# EAGLE design BPU_display (EAGLE 9.1.3)
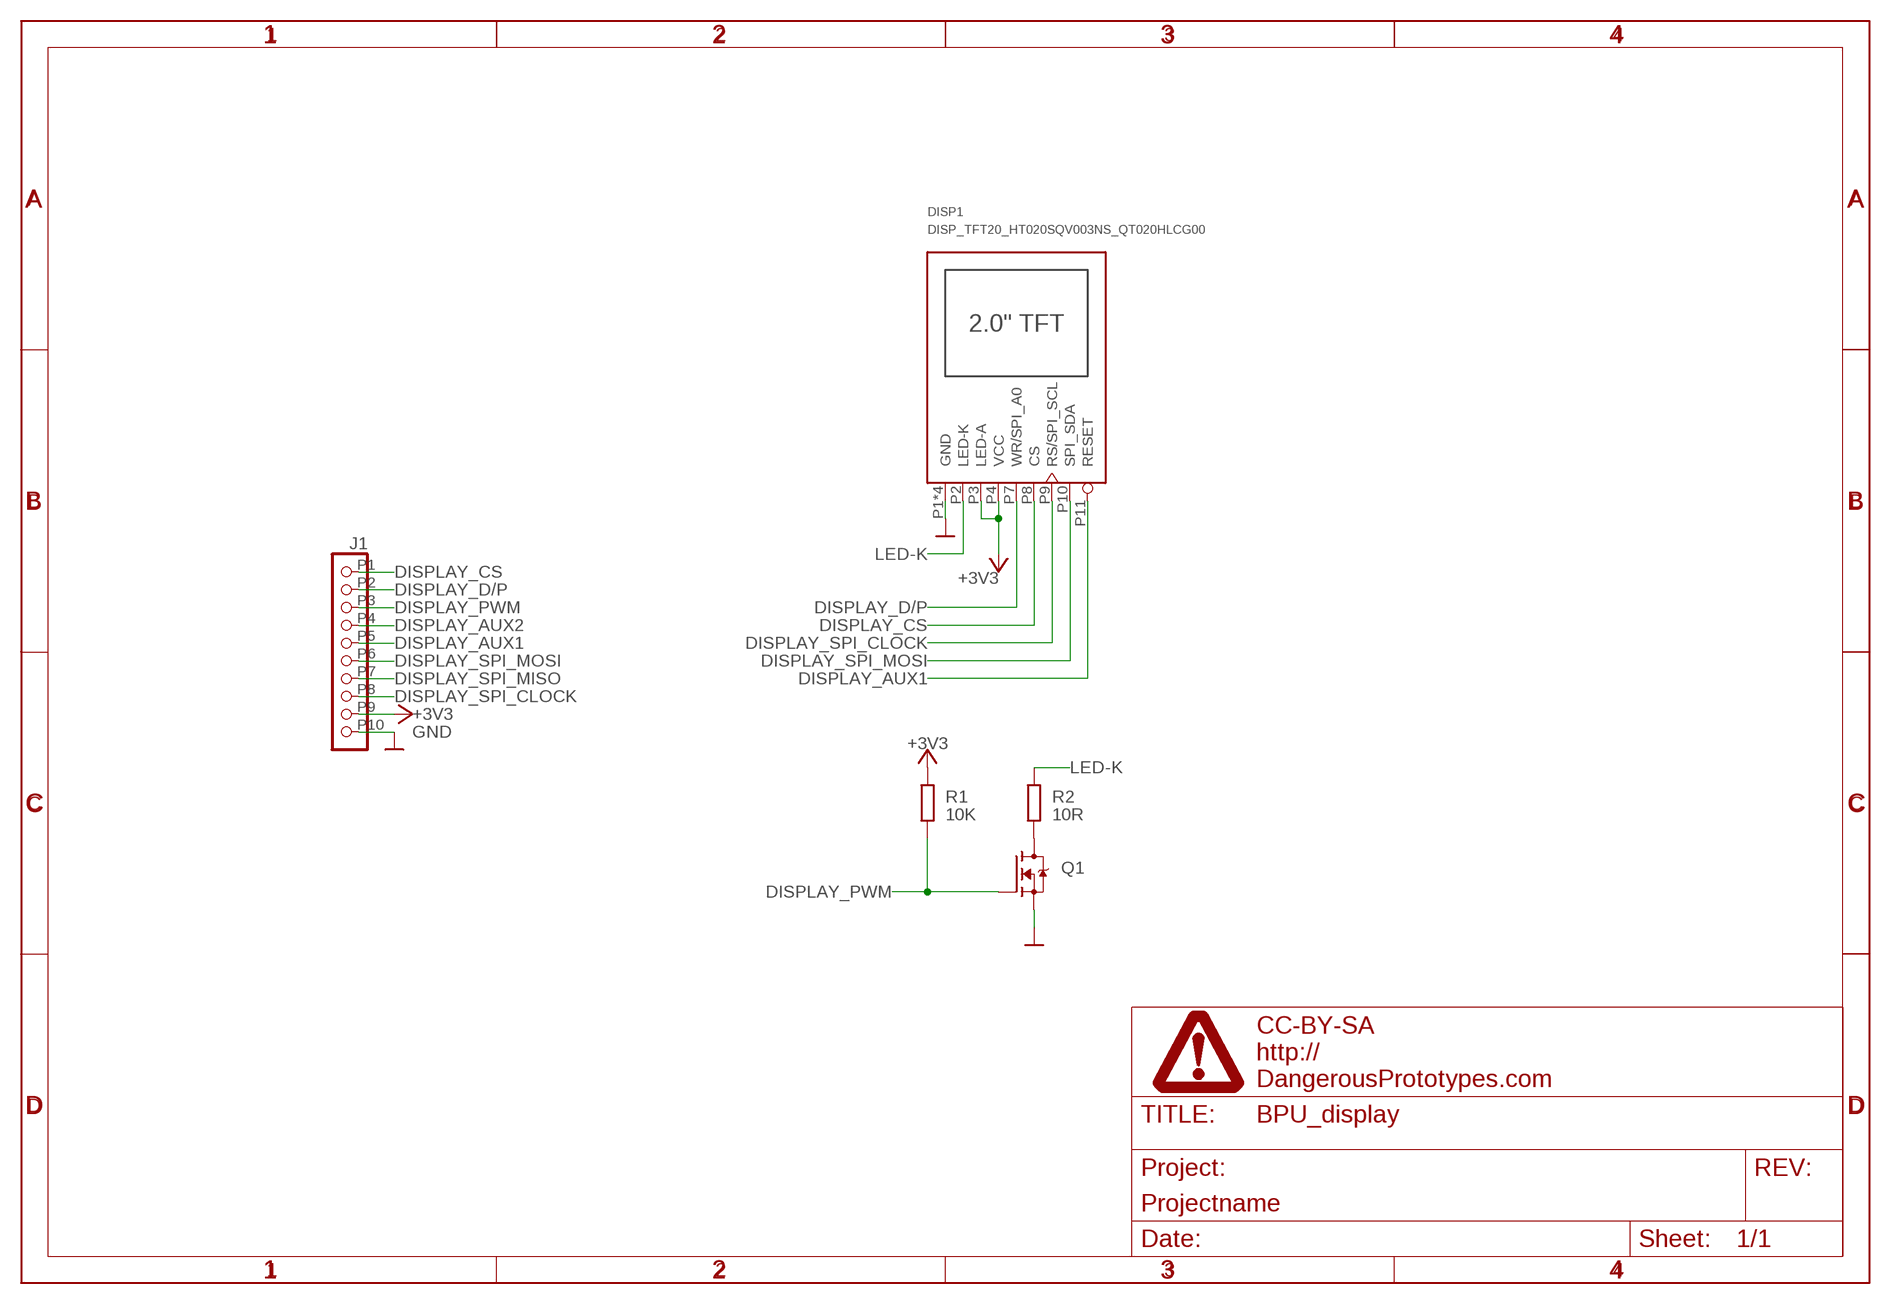
[diagram p0: schematic, sheet 1]

## Parts
DISP1  DISP_TFT20_HT020SQV003NS_QT020HLCG00  [HT020SQV003NS_QT020HLCG00]
J1  CON_MOLEX_MALE_SMT_RIGHT_ANGLE_1.25  [MOLEX_532611071]
PAGE1  FRAME_DINA4_L  [DP_LOGO]
Q1  TRANSISTOR_FET_BS170-SOT-23  [SOT-23]
R1  10K  R-EU_R0603  [R0603]
R2  10R  R-EU_R0603  [R0603]

## Nets
+3V3: DISP1.P3(LED-A) DISP1.P4(VCC) J1.P9 R1.2 ; supply symbol labelled SUPPLY_+3V3
DISPLAY_AUX1: DISP1.P11(RESET) J1.P5
DISPLAY_AUX2: J1.P4
DISPLAY_CS: DISP1.P8(CS) J1.P1
DISPLAY_D/P: DISP1.P7(WR/SPI_A0) J1.P2
DISPLAY_PWM: J1.P3 Q1.1(G) R1.1
DISPLAY_SPI_CLOCK: DISP1.P9(RS/SPI_SCL) J1.P8
DISPLAY_SPI_MISO: J1.P7
DISPLAY_SPI_MOSI: DISP1.P10(SPI_SDA) J1.P6
GND: DISP1.P1(GND) DISP1.P5(GND) DISP1.P6(GND) DISP1.P12(GND) J1.P10 Q1.2(S) ; supply symbol labelled SUPPLY_GND
LED-K: DISP1.P2(LED-K) R2.2
N$2: Q1.3(D) R2.1

## Library data of the parts
DISP1 = dp_devices.v6:DISP_TFT20_HT020SQV003NS_QT020HLCG00: 2 in 1 2.0" TFT display, HT020SQV003NS and QT020HLCG00
J1 = dp_devices.v6:CON_MOLEX_MALE_SMT_RIGHT_ANGLE_1.25: Molex 1.25mm PicoBlade Header right angle SMT 10 circuits p/n: 532611071
PAGE1 = dp_devices.v6:FRAME_DINA4_L: A4 DP frame Standard Dangerous Prototypes schematic frame. Automagically adds the DP logo and standard texts to the PCB Use the atrribute in the schematic editor to change the fields.; FF1: fulfillment by; FF2: Seeed Studio; FF3: www.seeedstudio.com; LICENSE: CC-BY-SA; PROJECT: Projectname; URL1: http://; URL2: DangerousPrototypes.com
Q1 = dp_devices.v6:TRANSISTOR_FET_BS170: N-Channel Enhancement Mode Field Effect Transistor
R1 R2 = rcl:R-EU_: RESISTOR, European symbol; SPICEPREFIX: R

## Board
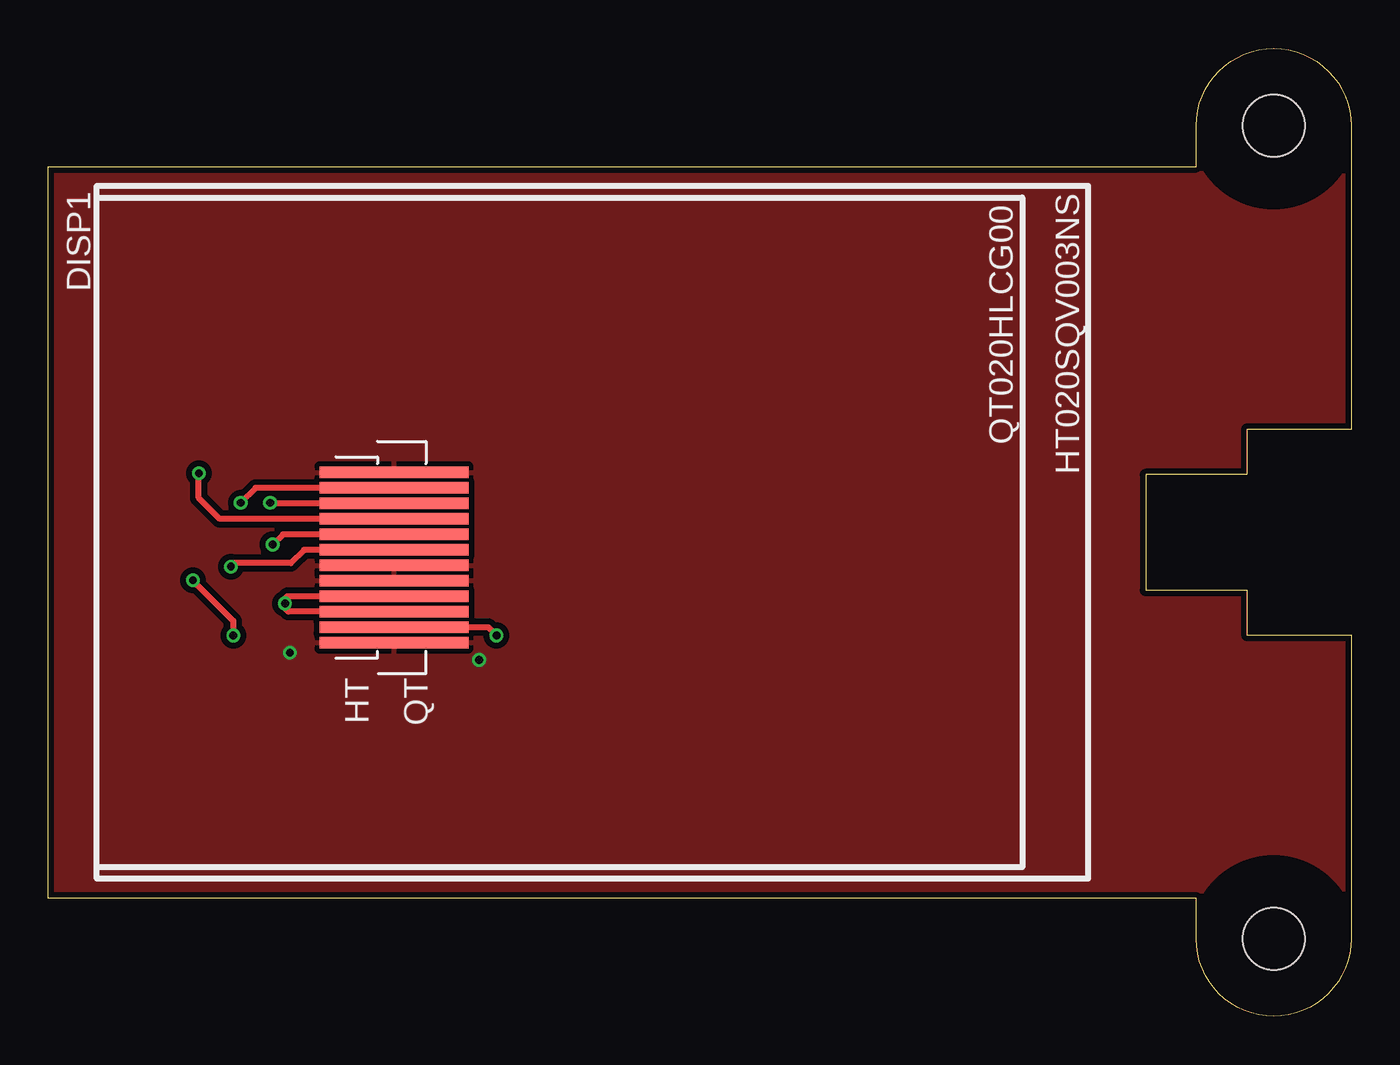
[diagram p1: board, top side]
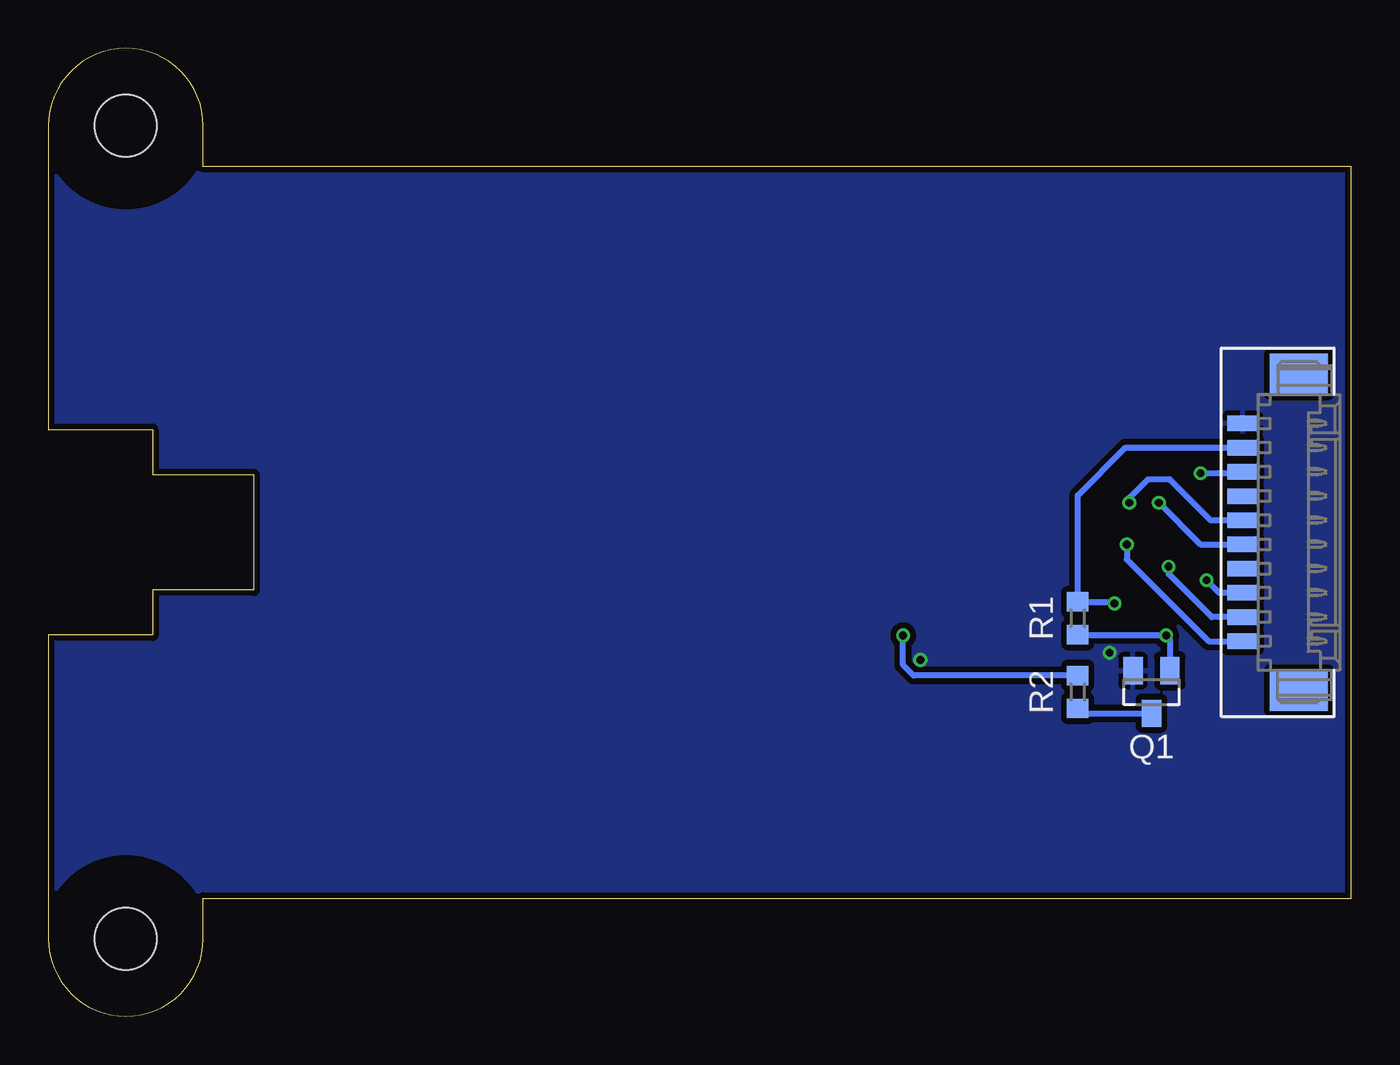
[diagram p2: board, bottom side, seen from below]

Size 67.29 x 50 mm. Coordinates in mm from the lower left corner, seen from the top.
Outline: 0,43.9 59.29,43.9 59.29,46 arc-180 67.29,46 67.29,30.31 61.91,30.31 61.91,27.98 56.68,27.98 56.68,22.02 61.91,22.02 61.91,19.69 67.29,19.69 67.29,4 arc-180 59.29,4 59.29,6.1 0,6.1 0,43.9
Copper layers (1*16): Top 0.035mm / dielectric 1.5mm / Bottom 0.035mm
Design rules "dirt_cheap_dirty_boards.v1.1": minimum track width 6mil, minimum drill 12mil, track to track 6mil, track to pad 6mil, pad to pad 6mil, via to via 6mil, smd to smd 0mil, copper to edge 10mil, drill to drill 10mil, minimum pad ring 10mil, minimum via ring 6mil, stop-mask expansion 2mil, vias tented up to drill 25mil, thermal gap 10mil
Holes 3.2 mm at 63.29,46 63.29,4
tRestrict: area 59.3,42 to 67.3,50; area 59.3,0 to 67.3,8
bRestrict: area 59.3,0 to 67.3,8; area 59.3,42 to 67.3,50

### Footprints (pad centres in the part's own frame; a part is rotated, then mirrored left to right if it is on the bottom)
HT020SQV003NS_QT020HLCG00 = smd 0.6 x 7.7: P1 5.7,-10.25; P2 4.9,-10.25; P3 4.1,-10.25; P4 3.3,-10.25; P5 2.5,-10.25; P6 1.7,-10.25; P7 0.9,-10.25; P8 0.1,-10.25; P9 -0.7,-10.25; P10 -1.5,-10.25; P11 -2.3,-10.25; P12 -3.1,-10.25
MOLEX_532611071 = smd 2.1 x 3: B1 -8.175,0; B2 8.175,0 | smd 0.8 x 1.6: P1 -5.625,2.9; P2 -4.375,2.9; P3 -3.125,2.9; P4 -1.875,2.9; P5 -0.625,2.9; P6 0.625,2.9; P7 1.875,2.9; P8 3.125,2.9; P9 4.375,2.9; P10 5.625,2.9
SOT-23 = smd 1 x 1.4: 1 -0.95,-1.1; 2 0.95,-1.1; 3 0,1.1
R0603 = smd 1 x 1.1: 1 -0.85,0; 2 0.85,0

### Placement (x,y rotation side)
DISP1  28.1,25 270 top
J1  2.7,25 90 bottom
PAGE1  3.96,0.24 0 top
Q1  10.32,16.75 180 bottom
R1  14.12,20.56 90 bottom
R2  14.12,16.75 90 bottom

### Tracks (layer width: path | path; a pad name or v marks a point on that pad's centre or on a via)
+3V3  (via drill 0.41)
  Top 0.305: DISP1.P3 12.39,20.9 12.22,21.07 v12.22,21.32 12.22,21.58 12.35,21.7 DISP1.P4
  Bottom 0.305: v12.22,21.32 12.31,21.41 R1.2 14.12,26.91 11.66,29.38 J1.P9
DISPLAY_AUX1  (via drill 0.41)
  Top 0.305: DISP1.P11 10.7,27.3 v9.93,26.53
  Bottom 0.305: v9.93,26.53 7.78,24.38 J1.P5
DISPLAY_CS  (via drill 0.41)
  Top 0.305: DISP1.P8 12.11,24.9 v11.59,24.37
  Bottom 0.305: J1.P1 7.35,19.38 11.59,23.61 v11.59,24.37
DISPLAY_D/P  (via drill 0.41)
  Top 0.305: v9.43,23.23 9.6,23.41 12.52,23.41 13.21,24.1 DISP1.P7
  Bottom 0.305: J1.P2 7.2,20.62 9.43,22.85 v9.43,23.23
DISPLAY_PWM  (via drill 0.41)
  Top 0.305: v7.46,22.52 9.55,20.43 v9.55,19.67
  Bottom 0.305: J1.P3 6.81,21.88 v7.46,22.52 | Q1.1 9.36,19.48 v9.55,19.67 9.59,19.71 R1.1
DISPLAY_SPI_CLOCK  (via drill 0.41)
  Top 0.305: DISP1.P9 8.86,25.7 7.77,26.78 v7.77,28.05
  Bottom 0.305: v7.77,28.05 5.67,28.05 J1.P8
DISPLAY_SPI_MOSI  (via drill 0.41)
  Top 0.305: DISP1.P10 11.49,26.5 v11.46,26.53
  Bottom 0.305: J1.P6 7.26,25.62 9.38,27.75 10.48,27.75 11.46,26.77 v11.46,26.53
GND  (via drill 0.41)
  other vias: 12.47,18.78 22.25,18.4
  pour Top (isolate 0.305, rank 6): 0,43.9 67.29,43.9 67.29,6.1 0,6.1
  pour Bottom (isolate 0.305, rank 6): 0,43.9 67.29,43.9 67.29,6.1 0,6.1
LED-K  (via drill 0.41)
  Top 0.305: DISP1.P2 22.71,20.1 v23.14,19.67
  Bottom 0.305: R2.2 22.6,17.6 23.14,18.15 v23.14,19.67
N$2
  Bottom 0.305: R2.1 13.88,15.65 Q1.3